# EAGLE design low_level_contoller_board2 (EAGLE 9.0.0)
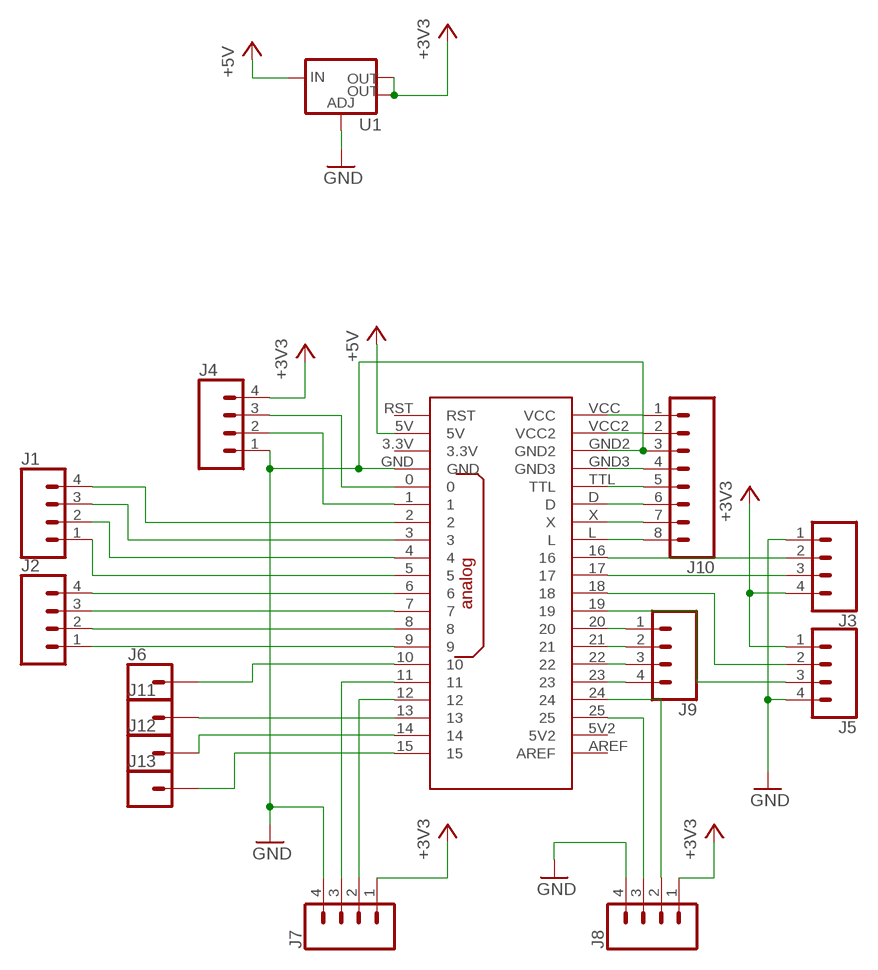
[diagram p0: schematic, sheet 1]

## Parts
J1  CONN_04POLAR  [MOLEX-1X4]
J2  CONN_04POLAR  [MOLEX-1X4]
J3  CONN_04  [1X04]
J4  CONN_04  [1X04]
J5  CONN_04  [1X04]
J6  CONN_01  [1X01]
J7  CONN_04  [1X04]
J8  CONN_04  [1X04]
J9  CONN_04  [1X04]
J10  CONN_08"  [1X08]
J11  CONN_01  [1X01]
J12  CONN_01  [1X01]
J13  CONN_01  [1X01]
U1  V_REG_LM1117SOT223  [SOT223]
U$1  OPENCM9.04  [OPENCM9.04]

## Nets
+3V3: J3.4 J4.4 J5.1 J7.1 J8.1 U1.2(OUT) U1.4(OUT)
+5V: U1.3(IN) U$1.5V
GND: J3.1 J4.1 J5.4 J7.4 J8.4 J10.3 U1.1(ADJ) U$1.GND U$1.GND2
N$1: J1.4 U$1.2
N$2: J1.3 U$1.3
N$3: J1.2 U$1.4
N$4: J1.1 U$1.5
N$5: J2.4 U$1.6
N$6: J2.3 U$1.7
N$7: J2.2 U$1.8
N$8: J2.1 U$1.9
N$9: J3.2 U$1.16
N$10: J3.3 U$1.17
N$11: J5.2 U$1.18
N$12: J5.3 U$1.19
N$13: J4.3 U$1.0
N$14: J4.2 U$1.1
N$15: J6.1 U$1.10
N$16: J11.1 U$1.13
N$17: J7.3 U$1.11
N$18: J7.2 U$1.12
N$19: J9.1 U$1.20
N$20: J8.3 U$1.25
N$21: J8.2 U$1.24
N$22: J9.2 U$1.21
N$23: J9.3 U$1.22
N$24: J9.4 U$1.23
N$25: J10.1 U$1.VCC
N$26: J10.2 U$1.VCC2
N$27: J12.1 U$1.14
N$28: J10.4 U$1.GND3
N$29: J10.5 U$1.TTL
N$30: J10.6 U$1.D
N$31: J10.7 U$1.X
N$32: J10.8 U$1.L
N$33: J13.1 U$1.15
Unconnected: U$1.3.3V U$1.5V2 U$1.AREF U$1.RST

## Library data of the parts
J1 J2 = SparkFun-Connectors:CONN_04: Multi connection point. Often used as Generic Header-pin footprint for 0.1 inch spaced/style header connections On any of the 0.1 inch spaced packages, you can populate with these: Break Away Headers - Straight <https://www.sparkfun.com/products/116> (PRT-00116) Break Away Male Headers - Right Angle <https://www.sparkfun.com/products/553> (PRT-00553) Female Headers <https://www.sparkfun.com/products/115> (PRT-00115) Break Away Headers - Machine Pin <https://www.sparkfun.com/products/117> (PRT-00117) Break Away Female Headers - Swiss Machine Pin <https://www.sparkfun.com/products/743> (PRT-00743) For SCREWTERMINALS and SPRING TERMINALS visit here: Screw Terimnals on SparkFun.com <https://www.sparkfun.com/search/results?term=Screw+Terminals> (5mm/3.5mm/2.54mm spacing) This device is also useful as a general connection point to wire up your design to another part of your project. Our various solder wires solder well into these plated through hole pads. Hook-Up Wire - Assortment (Stranded, 22 AWG) <https://www.sparkfun.com/products/11375> (PRT-11375) Hook-Up Wire - Assortment (Solid Core, 22 AWG) <https://www.sparkfun.com/products/11367> (PRT-11367) View the entire wire category on our website here <https://www.sparkfun.com/categories/141> Special notes: Molex polarized connector foot print use with SKU : PRT-08231 with associated crimp pins and housings. 1MM SMD Version SKU: PRT-10208; PROD_ID: CONN-08186; SF_ID: PRT-08231
J3-J5 J7-J9 = SparkFun-Connectors:CONN_04: Multi connection point. Often used as Generic Header-pin footprint for 0.1 inch spaced/style header connections On any of the 0.1 inch spaced packages, you can populate with these: Break Away Headers - Straight <https://www.sparkfun.com/products/116> (PRT-00116) Break Away Male Headers - Right Angle <https://www.sparkfun.com/products/553> (PRT-00553) Female Headers <https://www.sparkfun.com/products/115> (PRT-00115) Break Away Headers - Machine Pin <https://www.sparkfun.com/products/117> (PRT-00117) Break Away Female Headers - Swiss Machine Pin <https://www.sparkfun.com/products/743> (PRT-00743) For SCREWTERMINALS and SPRING TERMINALS visit here: Screw Terimnals on SparkFun.com <https://www.sparkfun.com/search/results?term=Screw+Terminals> (5mm/3.5mm/2.54mm spacing) This device is also useful as a general connection point to wire up your design to another part of your project. Our various solder wires solder well into these plated through hole pads. Hook-Up Wire - Assortment (Stranded, 22 AWG) <https://www.sparkfun.com/products/11375> (PRT-11375) Hook-Up Wire - Assortment (Solid Core, 22 AWG) <https://www.sparkfun.com/products/11367> (PRT-11367) View the entire wire category on our website here <https://www.sparkfun.com/categories/141> Special notes: Molex polarized connector foot print use with SKU : PRT-08231 with associated crimp pins and housings. 1MM SMD Version SKU: PRT-10208; PROD_ID: CONN-09696
J6 J11-J13 = SparkFun-Connectors:CONN_01: Single connection point. Often used as Generic Header-pin footprint for 0.1 inch spaced/style header connections On any of the 0.1 inch spaced packages, you can populate with these: Break Away Headers - Straight <https://www.sparkfun.com/products/116> (PRT-00116) Break Away Male Headers - Right Angle <https://www.sparkfun.com/products/553> (PRT-00553) Female Headers <https://www.sparkfun.com/products/115> (PRT-00115) Break Away Headers - Machine Pin <https://www.sparkfun.com/products/117> (PRT-00117) Break Away Female Headers - Swiss Machine Pin <https://www.sparkfun.com/products/743> (PRT-00743) This device is also useful as a general connection point to wire up your design to another part of your project. Our various solder wires solder well into these plated through hole pads. Hook-Up Wire - Assortment (Stranded, 22 AWG) <https://www.sparkfun.com/products/11375> (PRT-11375) Hook-Up Wire - Assortment (Solid Core, 22 AWG) <https://www.sparkfun.com/products/11367> (PRT-11367) View the entire wire category on our website here <https://www.sparkfun.com/categories/141> Special notes: SMTSO-256-ET is a "flush mount" nut for a 4-40 screw. We mostly use this on specialty testbeds; it is a nice way to connect hardware to your PCB at an adjustable hieght. Also note, the SNAP packages are for using a snappable style connector. We sell a baggie of snaps and they are also used on two LilyPad designs: Snap Assortment - 30 pack (male and female) <https://www.sparkfun.com/products/11347> (DEV-11347) LilyPad Arduino SimpleSnap <https://www.sparkfun.com/products/10941> (DEV-10941) LilyPad SimpleSnap Protoboard <https://www.sparkfun.com/products/10940> (DEV-10940)
J10 = SparkFun-Connectors:CONN_08: Multi connection point. Often used as Generic Header-pin footprint for 0.1 inch spaced/style header connections On any of the 0.1 inch spaced packages, you can populate with these: Break Away Headers - Straight <https://www.sparkfun.com/products/116> (PRT-00116) Break Away Male Headers - Right Angle <https://www.sparkfun.com/products/553> (PRT-00553) Female Headers <https://www.sparkfun.com/products/115> (PRT-00115) Break Away Headers - Machine Pin <https://www.sparkfun.com/products/117> (PRT-00117) Break Away Female Headers - Swiss Machine Pin <https://www.sparkfun.com/products/743> (PRT-00743) Arduino Stackable Header - 8 Pin <https://www.sparkfun.com/products/9279> (PRT-09279) For SCREWTERMINALS and SPRING TERMINALS visit here: Screw Terimnals on SparkFun.com <https://www.sparkfun.com/search/results?term=Screw+Terminals> (5mm/3.5mm/2.54mm spacing) This device is also useful as a general connection point to wire up your design to another part of your project. Our various solder wires solder well into these plated through hole pads. Hook-Up Wire - Assortment (Stranded, 22 AWG) <https://www.sparkfun.com/products/11375> (PRT-11375) Hook-Up Wire - Assortment (Solid Core, 22 AWG) <https://www.sparkfun.com/products/11367> (PRT-11367) View the entire wire category on our website here <https://www.sparkfun.com/categories/141> Special notes: Molex polarized connector foot print use with SKU : PRT-08231 with associated crimp pins and housings. 1MM SMD Version SKU: PRT-10208 NOTES ON THE VARIANTS LOCK and LOCK_LONGPADS... This footprint was designed to help hold the alignment of a through-hole component (i.e. 6-pin header) while soldering it into place. You may notice that each hole has been shifted either up or down by 0.005 of an inch from it's more standard position (which is a perfectly straight line). This slight alteration caused the pins (the squares in the middle) to touch the edges of the holes. Because they are alternating, it causes a "brace" to hold the component in place. 0.005 has proven to be the perfect amount of "off-center" position when using our standard breakaway headers. Although looks a little odd when you look at the bare footprint, once you have a header in there, the alteration is very hard to notice. Also,if you push a header all the way into place, it is covered up entirely on the bottom side.; PROD_ID: CONN-08438
U1 = SparkFun-IC-Power:V_REG_LM1117: Voltage Regulator LM1117 Standard adjustable voltage regulator but in SMD form. Spark Fun Electronics SKU : COM-00595; PROD_ID: VREG-08170
U$1 = OpenCM9.04:OPENCM9.04

## Board
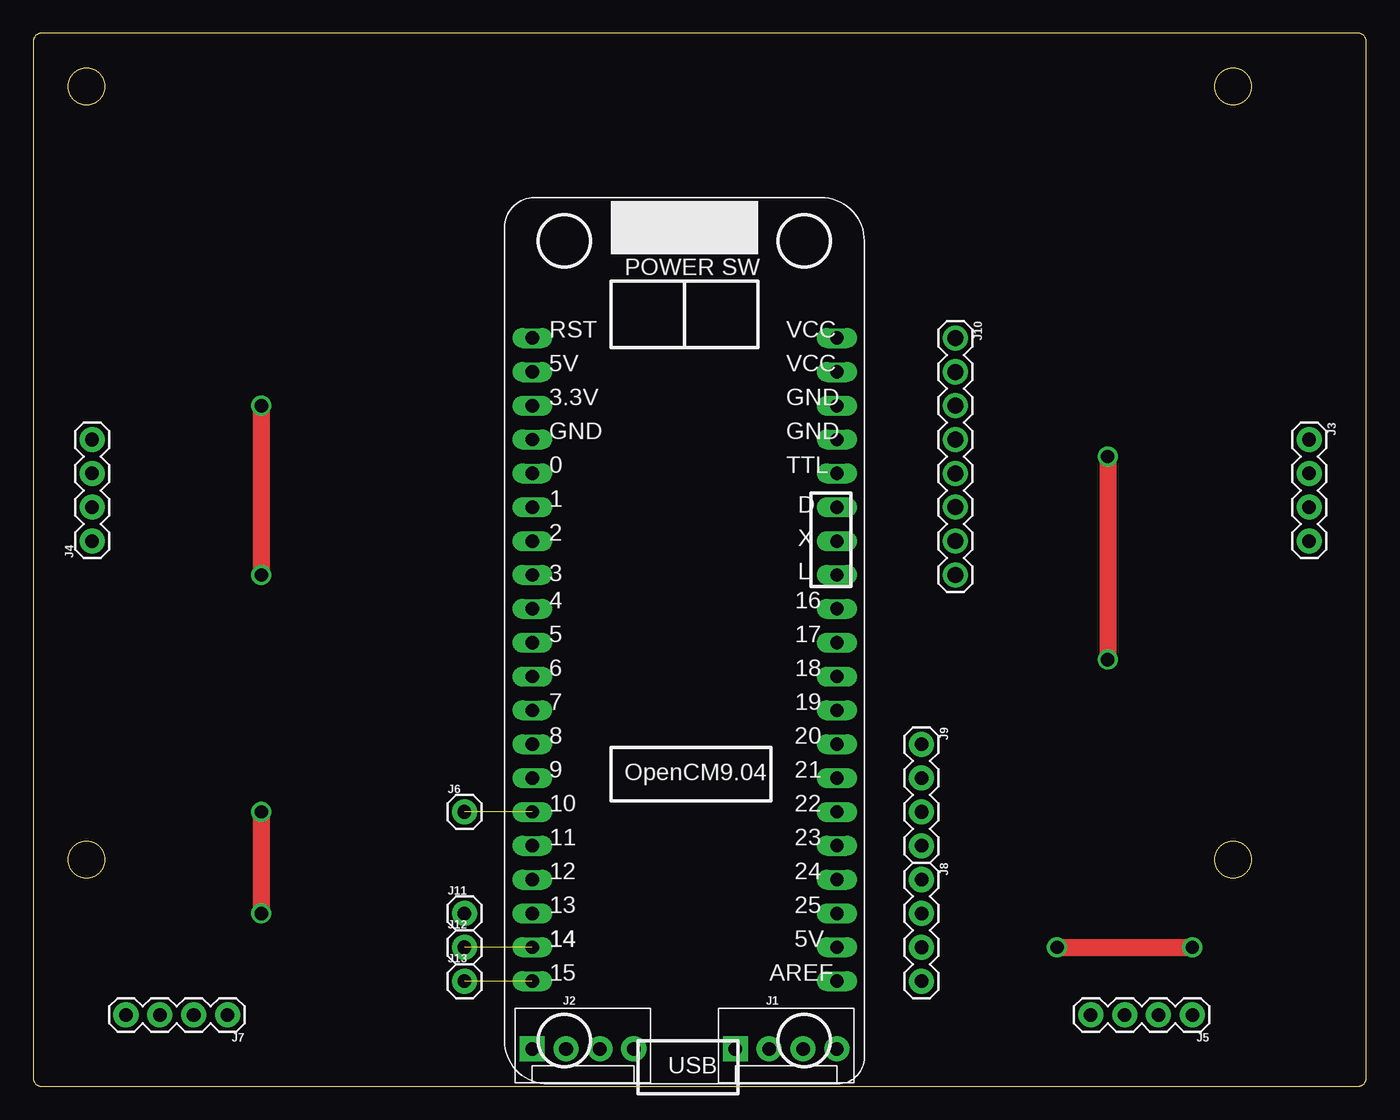
[diagram p1: board, top side]
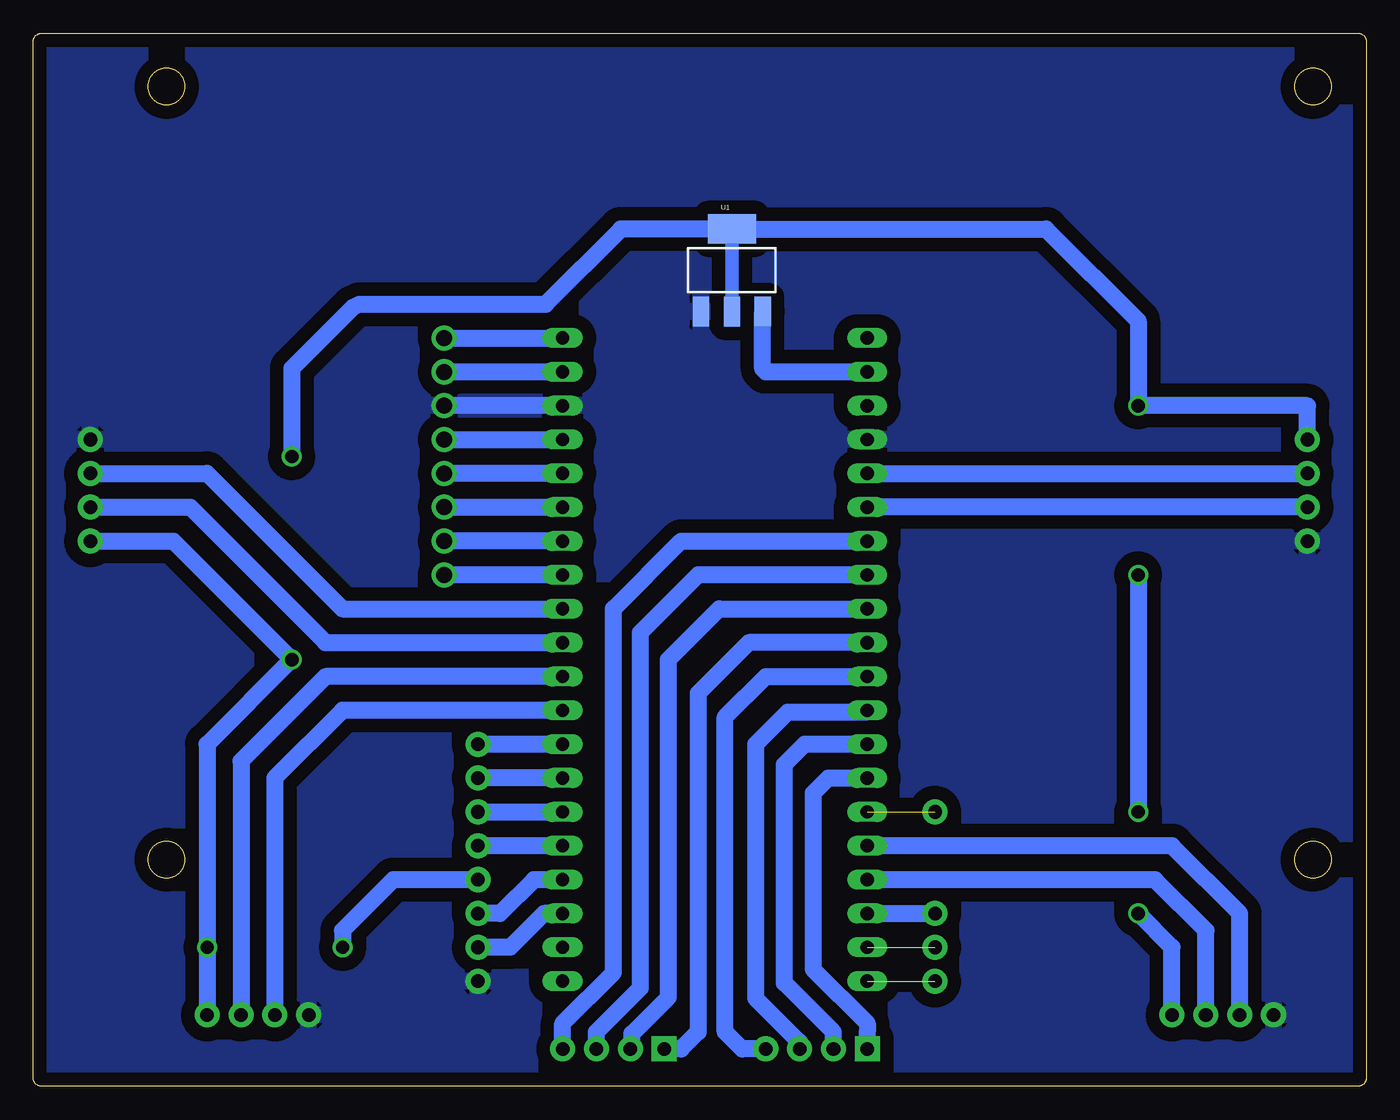
[diagram p2: board, bottom side, seen from below]

Size 100 x 79 mm. Coordinates in mm from the lower left corner, seen from the top.
Outline: 0,78.4 0,0.6 arc90 0.6,0 99.4,0 arc90 100,0.6 100,78.4 arc90 99.4,79 0.6,79 arc90 0,78.4
Outline: circle at 90,17 radius 1.38
Outline: circle at 4,17 radius 1.38
Outline: circle at 4,75 radius 1.38
Outline: circle at 90,75 radius 1.38
Copper layers (1*16): Top 0.035mm / dielectric 1.5mm / Bottom 0.035mm
Design rules "default": minimum track width 6mil, minimum drill 0.35mm, track to track 6mil, track to pad 6mil, pad to pad 6mil, via to via 6mil, smd to smd 6mil, copper to edge 40mil, drill to drill 6mil, minimum pad ring 10mil, minimum via ring 8mil, stop-mask expansion 4mil, vias tented up to drill 0mil, thermal gap 10mil

### Footprints (pad centres in the part's own frame; a part is rotated, then mirrored left to right if it is on the bottom)
MOLEX-1X4 = drill 1.016 pad 1.88 square: 1 0,0 | drill 1.016 pad 1.88: 2 2.54,0; 3 5.08,0; 4 7.62,0
1X04 = drill 1.016 pad 1.88: 1 0,0; 2 2.54,0; 3 5.08,0; 4 7.62,0
1X01 = drill 1.016 pad 1.88: 1 0,0
1X08 = drill 1.2 pad 1.88: 1 0,0; 2 2.54,0; 3 5.08,0; 4 7.62,0; 5 10.16,0; 6 12.7,0; 7 15.24,0; 8 17.78,0
SOT223 = smd 1.219 x 2.235: 1 -2.311,-3.099; 2 0,-3.099; 3 2.311,-3.099 | smd 3.6 x 2.2: 4 0,3.099
OPENCM9.04 = drill 1 long: 0 -11.43,12.7; 1 -11.43,10.16; 2 -11.43,7.62; 3 -11.43,5.08; 3.3V -11.43,17.78; 4 -11.43,2.54; 5 -11.43,0; 5V -11.43,20.32; 5V2 11.43,-22.86; 6 -11.43,-2.54; 7 -11.43,-5.08; 8 -11.43,-7.62; 9 -11.43,-10.16; 10 -11.43,-12.7; 11 -11.43,-15.24; 12 -11.43,-17.78; 13 -11.43,-20.32; 14 -11.43,-22.86; 15 -11.43,-25.4; 16 11.43,2.54; 17 11.43,0; 18 11.43,-2.54; 19 11.43,-5.08; 20 11.43,-7.62; 21 11.43,-10.16; 22 11.43,-12.7; 23 11.43,-15.24; 24 11.43,-17.78; 25 11.43,-20.32; AREF 11.43,-25.4; D 11.43,10.16; GND -11.43,15.24; GND2 11.43,17.78; GND3 11.43,15.24; L 11.43,5.08; RST -11.43,22.86; TTL 11.43,12.7; VCC 11.43,22.86; VCC2 11.43,20.32; X 11.43,7.62

### Placement (x,y rotation side)
J1  52.67,2.8 0 top
J2  37.43,2.8 0 top
J3  95.72,48.52 270 top
J4  4.41,40.9 90 top
J5  86.96,5.34 180 top
J6  32.35,20.58 0 top
J7  14.57,5.34 180 top
J8  66.64,15.5 270 top
J9  66.64,25.66 270 top
J10  69.18,56.14 270 top
J11  32.35,12.96 0 top
J12  32.35,10.42 0 top
J13  32.35,7.88 0 top
U1  47.59,61.22 0 bottom
U$1  48.86,33.28 0 top

### Tracks (layer width: path | path; a pad name or v marks a point on that pad's centre or on a via)
+3V3  (via drill 1)
  Top 1.27: v80.61,47.25 v80.61,32.01 | v17.11,51.06 v17.11,38.36 | v17.11,20.58 v17.11,12.96 | v76.8,10.42 v86.96,10.42
  Bottom 1.016: U1.4 U1.2
  Bottom 1.27: J5.1 v86.96,10.42 86.96,25.66 v80.61,32.01 89.5,40.9 J3.4 | v80.61,47.25 80.61,53.85 76.04,58.43 75.53,58.68 61.56,58.68 55.92,64.32 U1.4 24.02,64.32 17.11,57.41 v17.11,51.06 4.41,51.06 J4.4 | v17.11,38.36 v17.11,20.58 | J7.1 14.57,10.42 v17.11,12.96 | J8.1 72.99,15.5 76.8,11.69 v76.8,10.42
+5V
  Bottom 1.27: U$1.5V 45.05,53.6 45.28,53.83 U1.3
GND
  Bottom 1.27: U$1.GND2 J10.3
  pour Bottom (isolate 1.016): -1.94,80.27 -1.94,-2.28 102.2,-2.28 102.2,80.27
N$1
  Bottom 1.27: U$1.2 51.4,40.9 56.48,35.82 56.48,8.52 60.29,4.7 J1.4
N$2
  Bottom 1.27: U$1.3 50.13,38.36 54.45,34.04 54.45,7.37 57.75,4.07 J1.3
N$3
  Bottom 1.27: U$1.4 48.54,35.82 52.35,32.01 52.35,6.67 55.08,3.94 55.08,2.93 J1.2
N$4
  Bottom 1.27: U$1.5 46.32,33.28 50.13,29.47 50.13,4.07 51.4,2.8 J1.1
N$5
  Bottom 1.27: U$1.6 45.05,30.74 48.1,27.69 48.1,4.07 46.83,2.8 J2.4
N$6
  Bottom 1.27: U$1.7 37.56,28.07 43.4,28.07 45.81,25.66 45.81,6.61 42.51,3.31 J2.3
N$7
  Bottom 1.27: U$1.8 42.13,25.66 43.65,24.14 43.65,7.75 39.97,4.07 J2.2
N$8
  Bottom 1.27: U$1.9 40.35,23.12 41.49,21.98 41.49,8.77 37.43,4.7 37.43,4.07 J2.1
N$9
  Bottom 1.27: U$1.16 76.8,35.82 86.96,45.98 J3.2
N$10
  Bottom 1.27: U$1.17 78.07,33.28 88.23,43.44 J3.3
N$11
  Bottom 1.27: U$1.18 78.07,30.74 84.42,24.39 J5.2
N$12
  Bottom 1.27: U$1.19 76.8,28.2 81.88,23.12 J5.3
N$13
  Bottom 1.27: U$1.0 J4.3
N$14
  Bottom 1.27: J4.2 U$1.1
N$15  (1 unrouted)
N$16
  Bottom 1.27: U$1.13 J11.1
N$17
  Bottom 1.27: J7.3 9.49,12.96 14.57,18.04 U$1.11
N$18
  Bottom 1.27: U$1.12 15.84,15.5 12.03,11.69 J7.2
N$19
  Bottom 1.27: U$1.20 J9.1
N$20
  Bottom 1.27: U$1.25 61.69,12.96 64.23,10.42 J8.3
N$21
  Bottom 1.27: U$1.24 62.45,15.5 64.99,12.96 J8.2
N$22
  Bottom 1.27: U$1.21 J9.2
N$23
  Bottom 1.27: J9.3 U$1.22
N$24
  Bottom 1.27: U$1.23 J9.4
N$25
  Bottom 1.27: J10.1 U$1.VCC
N$26
  Bottom 1.27: U$1.VCC2 J10.2
N$27  (1 unrouted)
N$28
  Bottom 1.27: J10.4 U$1.GND3
N$29
  Bottom 1.27: U$1.TTL J10.5
N$30
  Bottom 1.27: J10.6 U$1.D
N$31
  Bottom 1.27: U$1.X J10.7
N$32
  Bottom 1.27: U$1.L J10.8
N$33  (1 unrouted)